# EAGLE design 10DOF_FeatherWing (EAGLE 7.5.0)
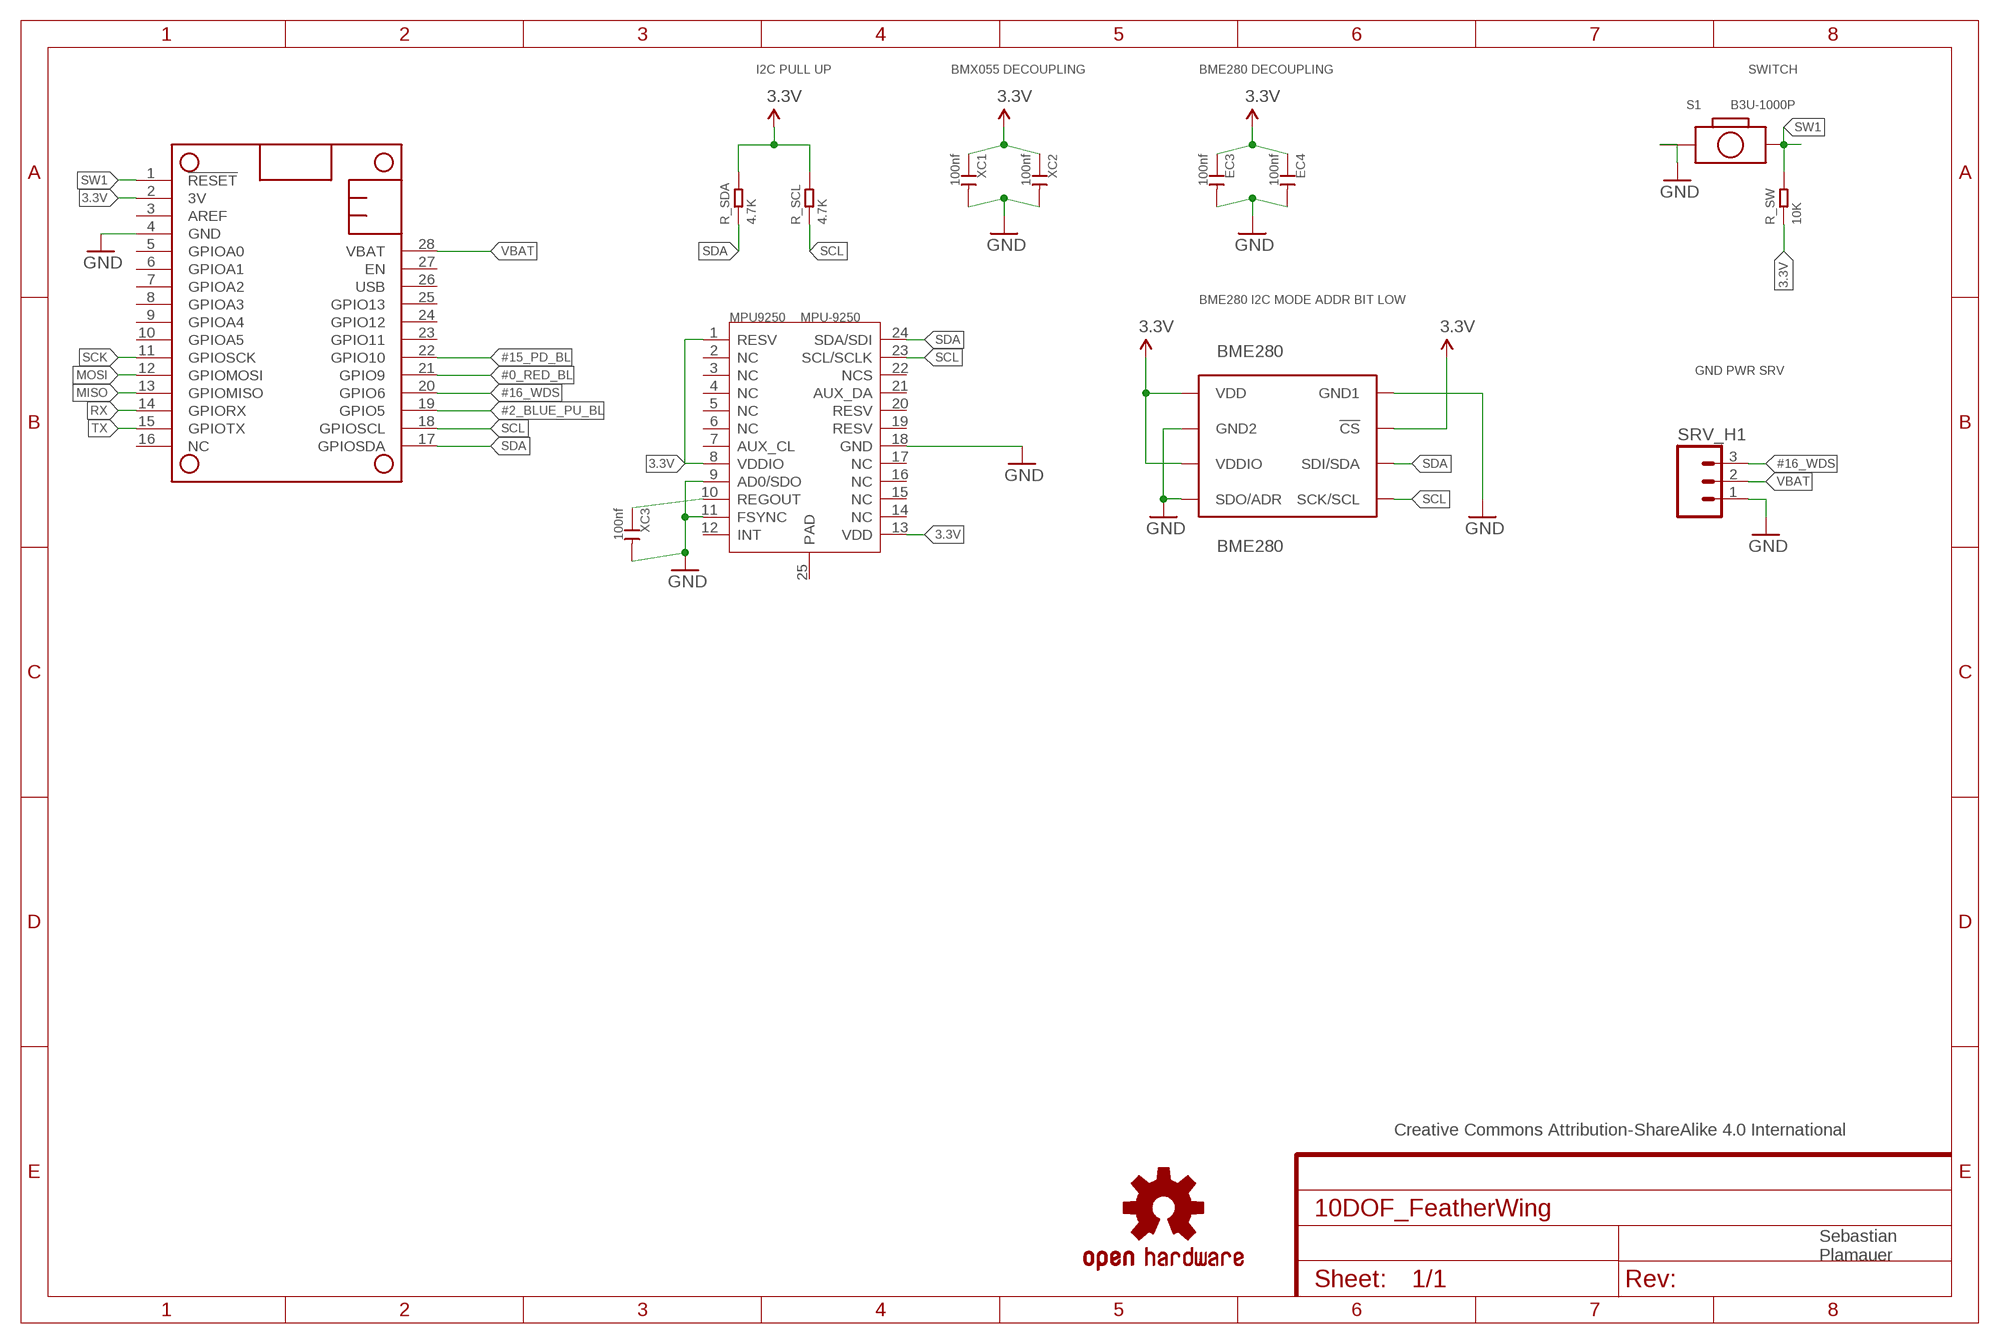
[diagram p0: schematic, sheet 1]

## Parts
BME280  BME280  BME280COMPONENTLIBRARY_BME280  [BME280COMPONENTLIBRARY_BME280_LGA]
EC3  100nf  CERAMIC-100NF-50V-10%-X7R(0603)  [C0603]
EC4  100nf  CERAMIC-100NF-50V-10%-X7R(0603)  [C0603]
LOGO1  OSHW-LOGOS  [OSHW-LOGO-S]
MPU9250  MPU-9250  MOTION/POSITION-MPU-9250(QFN24)  [QFN24G-0.4-3X3MM]
MS1  FEATHERWING  [FEATHERWING]
R_SCL  4.7K  SMD-RES-4.7K-5%-1/10W(0603)  [R0603]
R_SDA  4.7K  SMD-RES-4.7K-5%-1/10W(0603)  [R0603]
R_SW  10K  SMD-RES-10K-1%-1/10W(0603)  [R0603]
S1  B3U-1000P  SMD-BUTTON-WITHOUT-BOSS-(2P-3X2.5MM)  [SW2-SMD-3.0X2.5X1.2+0.4MM]
SRV_H1  M03PTH  [1X03]
XC1  100nf  CERAMIC-100NF-50V-10%-X7R(0603)  [C0603]
XC2  100nf  CERAMIC-100NF-50V-10%-X7R(0603)  [C0603]
XC3  100nf  CERAMIC-100NF-50V-10%-X7R(0603)  [C0603]

## Nets
3.3V: BME280.P$2(!CS) BME280.P$6(VDDIO) BME280.P$8(VDD) EC3.1 EC4.1 MPU9250.1(RESV) MPU9250.8(VDDIO) MPU9250.13(VDD) MS1.2(3V) R_SCL.2 R_SDA.2 R_SW.1 XC1.1 XC2.1
#0_RED_BL: MS1.21(GPIO9)
#2_BLUE_PU_BL: MS1.19(GPIO5)
#15_PD_BL: MS1.22(GPIO10)
#16_WDS: MS1.20(GPIO6) SRV_H1.3
GND: BME280.P$1(GND1) BME280.P$5(SDO/ADR) BME280.P$7(GND2) EC3.2 EC4.2 MPU9250.9(AD0/SDO) MPU9250.11(FSYNC) MPU9250.18(GND) MS1.4(GND) S1.1 SRV_H1.1 XC1.2 XC2.2 XC3.2
MISO: MS1.13(GPIOMISO)
MOSI: MS1.12(GPIOMOSI)
N$2: MPU9250.10(REGOUT) XC3.1
RX: MS1.14(GPIORX)
SCK: MS1.11(GPIOSCK)
SCL: BME280.P$4(SCK/SCL) MPU9250.23(SCL/SCLK) MS1.18(GPIOSCL) R_SCL.1
SDA: BME280.P$3(SDI/SDA) MPU9250.24(SDA/SDI) MS1.17(GPIOSDA) R_SDA.1
SW1: MS1.1(!RESET) R_SW.2 S1.2
TX: MS1.15(GPIOTX)
VBAT: MS1.28(VBAT) SRV_H1.2
Unconnected: MPU9250.2(NC) MPU9250.3(NC) MPU9250.4(NC) MPU9250.5(NC) MPU9250.6(NC) MPU9250.7(AUX_CL) MPU9250.12(INT) MPU9250.14(NC) MPU9250.15(NC) MPU9250.16(NC) MPU9250.17(NC) MPU9250.19(RESV) MPU9250.20(RESV) MPU9250.21(AUX_DA) MPU9250.22(NCS) MPU9250.25(PAD) MS1.3(AREF) MS1.5(GPIOA0) MS1.6(GPIOA1) MS1.7(GPIOA2) MS1.8(GPIOA3) MS1.9(GPIOA4) MS1.10(GPIOA5) MS1.16(NC) MS1.23(GPIO11) MS1.24(GPIO12) MS1.25(GPIO13) MS1.26(USB) MS1.27(EN)

## Notes on the sheet
- I2C PULL UP | BMX055 DECOUPLING | BME280 DECOUPLING | SWITCH
- BME280 I2C MODE ADDR BIT LOW
- GND PWR SRV
- Creative Commons Attribution-ShareAlike 4.0 International
- Sebastian
  Plamauer

## Library data of the parts
BME280 = SparkFun_BME280_Breakout_v10:BME280COMPONENTLIBRARY_BME280; PROD_ID: IC-13090
EC3 EC4 XC1-XC3 = Seeed-OPL-Capacitor:CERAMIC-100NF-50V-10%-X7R(0603): 302010138; MPN: CC0603KRX7R9BB104
LOGO1 = SparkFun-Aesthetics:OSHW-LOGO: Open Source Hardware Logo This logo indicates the piece of hardware it is found on incorporates a OSHW license and/or adheres to the definition of open source hardware found here: http://freedomdefined.org/OSHW
MPU9250 = Seeed-OPL-sensor:MOTION/POSITION-MPU-9250(QFN24): 314990005; MPN: MPU-9250
MS1 = adafruit:FEATHERWING
R_SCL R_SDA = Seeed-OPL-Resistor:SMD-RES-4.7K-5%-1/10W(0603): 301010290; MPN: RC0603JR-074K7L
R_SW = Seeed-OPL-Resistor:SMD-RES-10K-1%-1/10W(0603): 301010299; MPN: RC0603FR-0710KL
S1 = Seeed-OPL-Button:SMD-BUTTON-WITHOUT-BOSS-(2P-3X2.5MM): 311020047; MPN: B3U-1000P
SRV_H1 = SparkFun-Connectors:M03: Header 3 Standard 3-pin 0.1" header. Use with straight break away headers (SKU : PRT-00116), right angle break away headers (PRT-00553), swiss pins (PRT-00743), machine pins (PRT-00117), and female headers (PRT-00115). Molex polarized connector foot print use with SKU : PRT-08232 with associated crimp pins and housings.

## Board
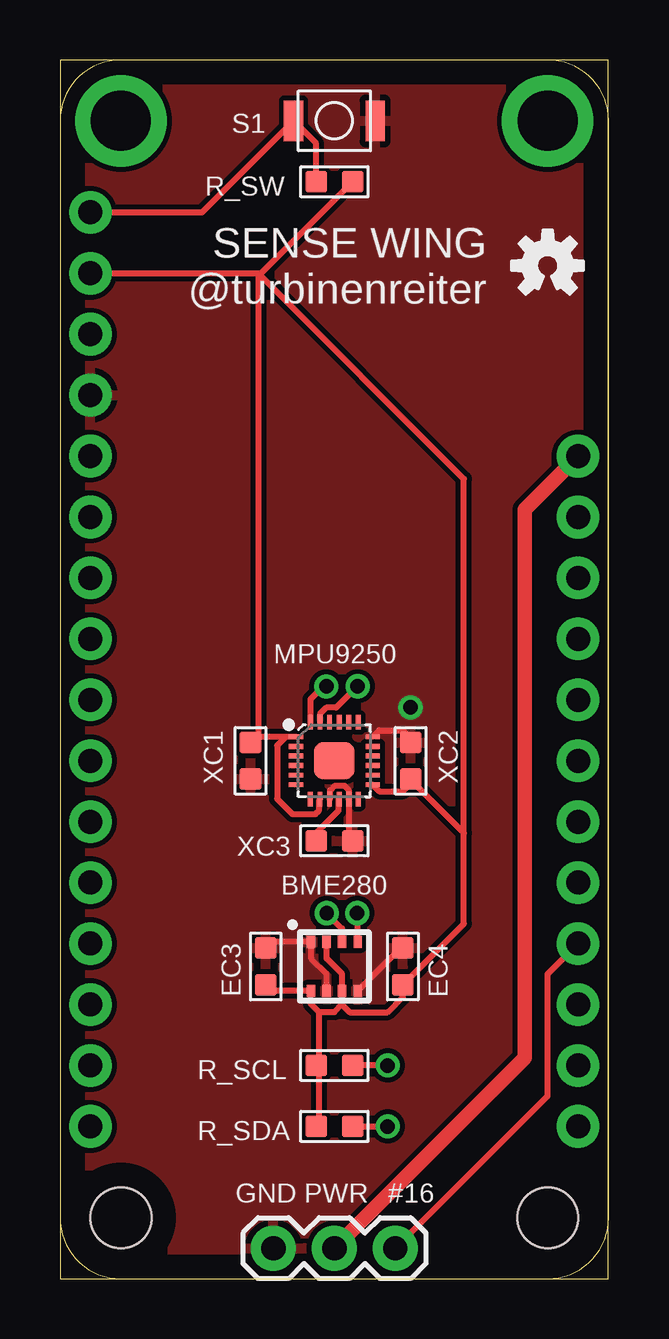
[diagram p1: board, top side]
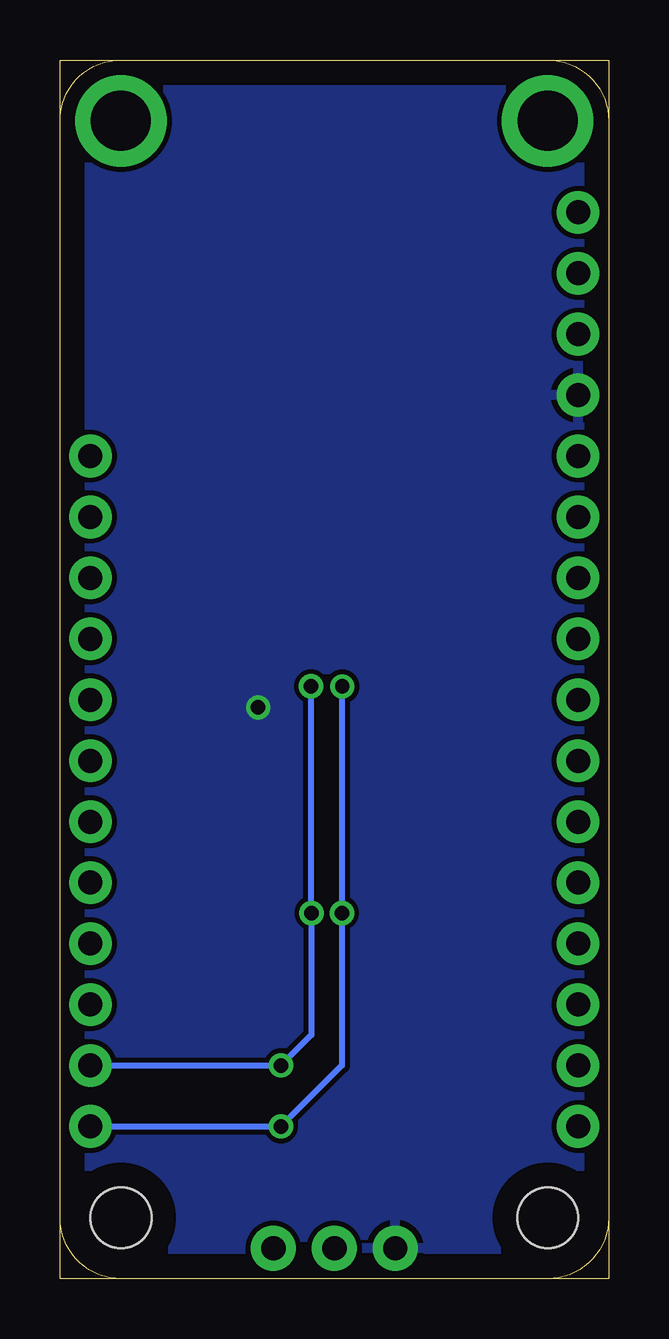
[diagram p2: board, bottom side, seen from below]

Size 22.86 x 50.8 mm. Coordinates in mm from the lower left corner, seen from the top.
Outline: 0,0 22.85,0 22.85,50.79 0,50.79 0,0
Copper layers (1*16): Top 0.035mm / dielectric 1.5mm / Bottom 0.035mm
Design rules "default": minimum track width 10mil, minimum drill 24mil, track to track 8mil, track to pad 8mil, pad to pad 8mil, via to via 8mil, smd to smd 8mil, copper to edge 40mil, drill to drill 8mil, minimum pad ring 10mil, minimum via ring 8mil, stop-mask expansion 4mil, vias tented up to drill 0mil, thermal gap 10mil

### Footprints (pad centres in the part's own frame; a part is rotated, then mirrored left to right if it is on the bottom)
BME280COMPONENTLIBRARY_BME280_LGA = smd 0.5 x 0.35: P$1 1.025,0.975; P$2 1.025,0.325; P$3 1.025,-0.325; P$4 1.025,-0.975; P$5 -1.025,-0.975; P$6 -1.025,-0.325; P$7 -1.025,0.325; P$8 -1.025,0.975
C0603 = smd 0.889 x 0.889: 1 0,0.762; 2 0,-0.762
QFN24G-0.4-3X3MM = smd 0.6 x 0.2: 1 -1.6,1; 2 -1.6,0.6; 3 -1.6,0.2; 4 -1.6,-0.2; 5 -1.6,-0.6; 6 -1.6,-1; 13 1.6,-1; 14 1.6,-0.6; 15 1.6,-0.2; 16 1.6,0.2; 17 1.6,0.6; 18 1.6,1 | smd 0.2 x 0.6: 7 -1,-1.6; 8 -0.6,-1.6; 9 -0.2,-1.6; 10 0.2,-1.6; 11 0.6,-1.6; 12 1,-1.6; 19 1,1.6; 20 0.6,1.6; 21 0.2,1.6; 22 -0.2,1.6; 23 -0.6,1.6; 24 -1,1.6 | smd 1.7 x 1.54: 25 0,0
FEATHERWING = drill 1 pad 1.778: 1 6.35,1.27; 2 8.89,1.27; 3 11.43,1.27; 4 13.97,1.27; 5 16.51,1.27; 6 19.05,1.27; 7 21.59,1.27; 8 24.13,1.27; 9 26.67,1.27; 10 29.21,1.27; 11 31.75,1.27; 12 34.29,1.27; 13 36.83,1.27; 14 39.37,1.27; 15 41.91,1.27; 16 44.45,1.27; 17 44.45,21.59; 18 41.91,21.59; 19 39.37,21.59; 20 36.83,21.59; 21 34.29,21.59; 22 31.75,21.59; 23 29.21,21.59; 24 26.67,21.59; 25 24.13,21.59; 26 21.59,21.59; 27 19.05,21.59; 28 16.51,21.59 | drill 2.5 pad 3.81: P$1 2.54,20.32; P$2 2.54,2.54 | hole 2.54: 48.26,20.32; 48.26,2.54
R0603 = smd 0.889 x 0.889: 1 0,0.762; 2 0,-0.762
SW2-SMD-3.0X2.5X1.2+0.4MM = smd 0.8 x 1.7: 1 -1.7,0; 2 1.7,0
1X03 = drill 1.016 pad 1.88: 1 0,0; 2 2.54,0; 3 5.08,0

### Placement (x,y rotation side)
BME280  11.43,13.02 90 top
EC3  8.57,13.02 180 top
EC4  14.29,13.02 180 top
LOGO1  20.32,42.23 0 top
MPU9250  11.43,21.59 0 top
MS1  0,50.8 270 top
R_SCL  11.43,8.89 270 top
R_SDA  11.43,6.35 270 top
R_SW  11.43,45.72 270 top
S1  11.43,48.26 180 top
SRV_H1  8.89,1.27 0 top
XC1  7.94,21.59 0 top
XC2  14.61,21.59 180 top
XC3  11.43,18.26 90 top

### Tracks (layer width: path | path; a pad name or v marks a point on that pad's centre or on a via)
3.3V
  Top 0.254: EC3.1 8.43,11.99 BME280.P$8 10.46,11.45 10.79,11.11 | BME280.P$6 11.76,11.42 12.06,11.11 13.65,11.11 14.29,11.75 EC4.1 16.83,14.8 16.83,18.57 | BME280.P$6 11.75,11.43 11.43,11.11 10.79,11.11 | 10.79,11.11 10.79,9.11 R_SCL.2 10.79,8.68 10.79,6.67 10.58,6.45 R_SDA.2 | BME280.P$6 11.75,12.7 11.11,13.34 BME280.P$2 | MPU9250.13 13.3,20.32 14.29,20.32 14.61,20.64 XC2.1 14.61,20.8 16.83,18.57 | MS1.2 8.26,41.91 | 8.26,41.91 8.38,41.91 R_SW.1 | 8.26,41.91 16.83,33.34 16.83,18.57 | 8.21,22.59 MPU9250.1 9.41,22.59 9.05,22.23 9.05,20 9.68,19.37 10.64,19.37 10.79,19.53 10.79,19.95 MPU9250.8 | XC1.1 8.18,22.59 8.21,22.59 | 8.26,41.91 8.26,22.54 8.21,22.59
#16_WDS
  Top 0.254: SRV_H1.3 20.32,7.62 20.32,12.7 MS1.20
GND  (via drill 0.6)
  Top 0.254: EC3.2 8.43,14.04 BME280.P$1 10.48,14.02 10.48,13.34 11.11,12.71 BME280.P$7 | EC4.2 14.28,13.87 BME280.P$5 12.4,12.04 12.38,12.06 | MPU9250.9 11.25,20.01 11.25,20.35 11.45,20.55 11.85,20.55 12.03,20.37 MPU9250.11 12.03,18.58 XC3.2 | MPU9250.18 13.3,22.86 14.29,22.86 14.61,22.54 XC2.2
  other vias: 14.61,23.81
  pour Top: 23.81,-0.64 23.81,51.44 -0.64,51.44 -0.64,-0.64
  pour Bottom: 0,0 23.18,0 23.18,50.8 0,50.8
N$2
  Top 0.254: MPU9250.10 11.6,19.96 11.6,19.5 10.58,18.48 XC3.1
SCL  (via drill 0.6)
  Top 0.254: 12.38,8.99 R_SCL.1 v13.65,8.89 | BME280.P$4 12.4,15.22 v12.38,15.24 | v12.4,24.7 11.51,23.8 11.1,23.8 10.83,23.53 MPU9250.23
  Bottom 0.254: MS1.18 v13.65,8.89 12.38,10.16 v12.38,15.24 12.4,15.26 v12.4,24.7
SDA  (via drill 0.6)
  Top 0.254: v11.11,15.24 11.75,14.61 BME280.P$3 | v11.1,24.69 10.97,24.69 10.43,24.15 MPU9250.24 | R_SDA.1 v13.65,6.35
  Bottom 0.254: MS1.17 v13.65,6.35 11.11,8.89 v11.11,15.24 11.1,15.25 v11.1,24.69
SW1
  Top 0.254: MS1.1 5.92,44.45 S1.2 10.67,47.32 R_SW.2
VBAT
  Top 0.61: MS1.28 19.37,32.07 19.37,9.21 SRV_H1.2

### Text on the board
tNames: SENSE WING / @turbinenreiter | GND | PWR | #16